# Altium schematic sheet Connector A.SchDoc
size A4; SheetNumber: 12; SheetTotal: 16
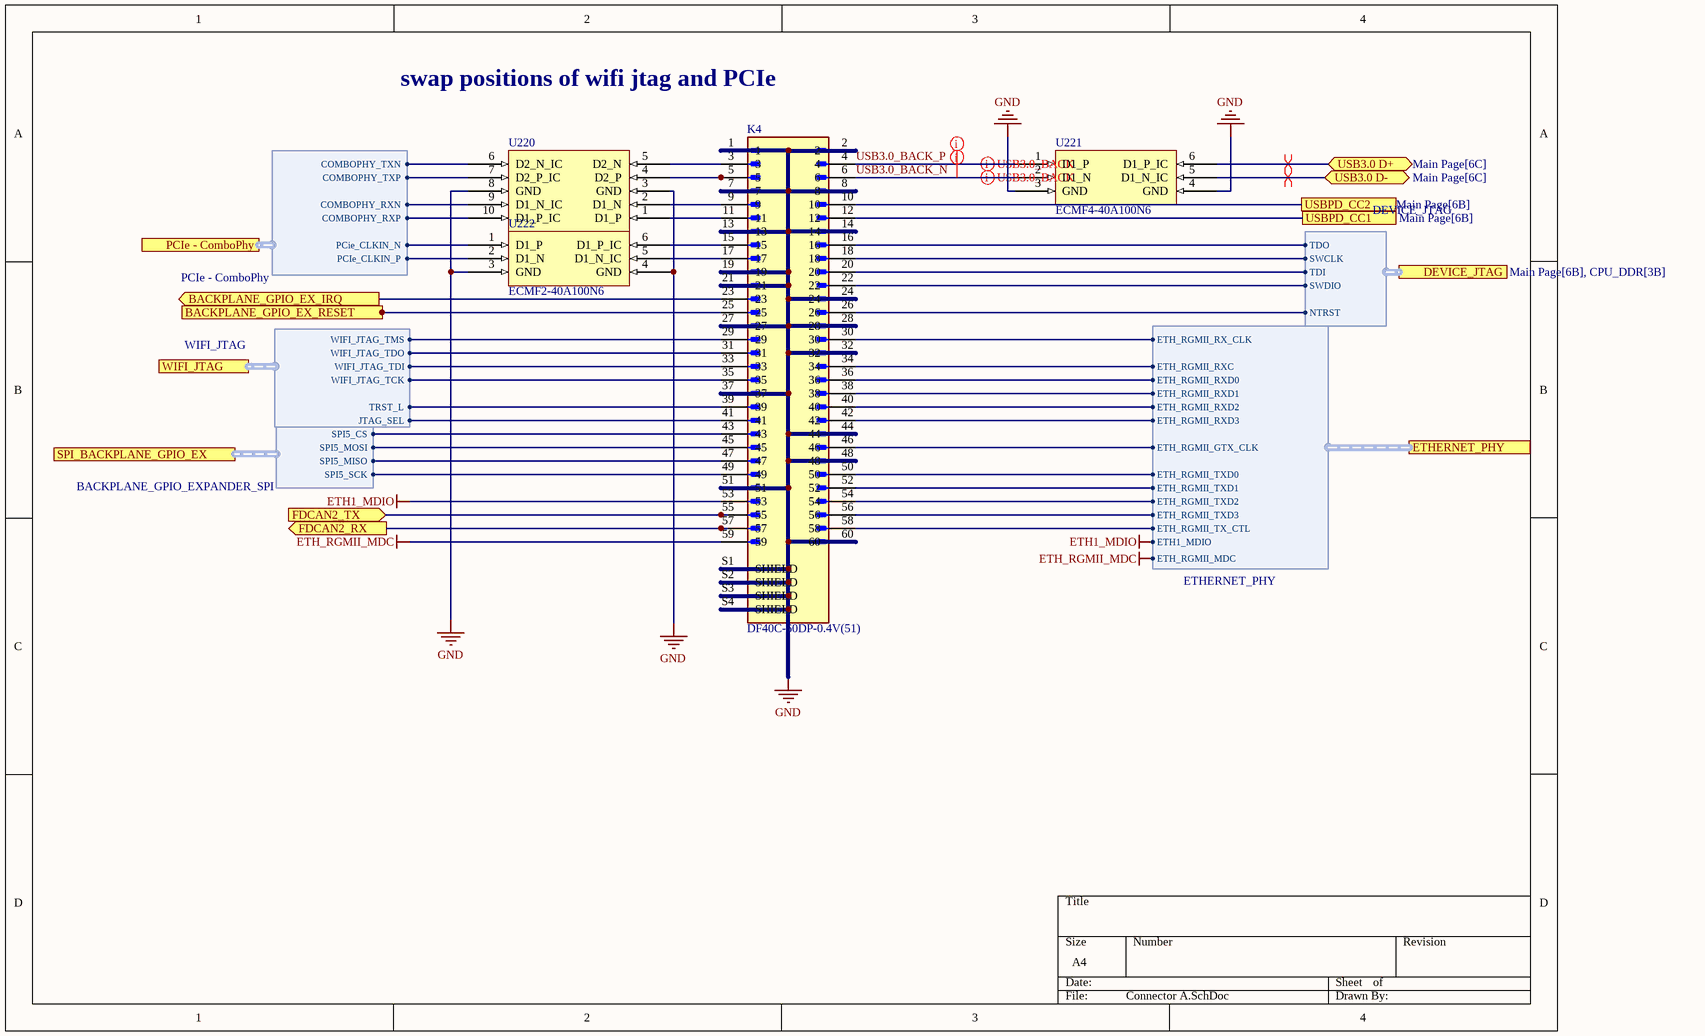
[diagram p0: Connector A.SchDoc]

## Parts
K4  DF40C-60DP-0.4V(51)  [HIROSE_DF40C-60DP-0.4V(51)]
U220  ECMF4-40A100N10  [ECMF4-40A100N10]  (value not drawn)
U221  ECMF4-40A100N6  [ECMF2-40A100N6]
U222  ECMF2-40A100N6  [ECMF2-40A100N6]

## Ports
BACKPLANE_GPIO_EX_IRQ (out, see Main Page[6C]), BACKPLANE_GPIO_EX_RESET (in, see Main Page[6C]), DEVICE_JTAG (harness DEVICE_JTAG, see Main Page[6B], CPU_DDR[3B]), ETHERNET_PHY (harness ETHERNET_PHY, see Main Page[6B]), FDCAN2_RX (out, see Main Page[6C], CPU_Peripherals[4E]), FDCAN2_TX (in, see Main Page[6B], CPU_Peripherals[4E]), PCIe - ComboPhy (harness PCIe - ComboPhy, see Main Page[6B]), SPI_BACKPLANE_GPIO_EX (harness BACKPLANE_GPIO_EXPANDER_SPI, see Main Page[6B], CPU_Peripherals[0B]), USB3.0 D+ (bidir, see Main Page[6C]), USB3.0 D- (bidir, see Main Page[6C]), USBPD_CC1 (see Main Page[6B]), USBPD_CC2 (see Main Page[6B]), WIFI_JTAG (harness WIFI_JTAG, see Main Page[6C], WIFI and BLE[6B])

## Harnesses
DEVICE_JTAG: NTRST, SWCLK, SWDIO, TDI, TDO
WIFI_JTAG: JTAG_SEL, TRST_L, WIFI_JTAG_TCK, WIFI_JTAG_TDI, WIFI_JTAG_TDO, WIFI_JTAG_TMS
PCIe - ComboPhy: COMBOPHY_RXN, COMBOPHY_RXP, COMBOPHY_TXN, COMBOPHY_TXP, PCie_CLKIN_N, PCIe_CLKIN_P
ETHERNET_PHY: ETH_RGMII_GTX_CLK, ETH_RGMII_RXC, ETH_RGMII_RXD0, ETH_RGMII_RXD1, ETH_RGMII_RXD2, ETH_RGMII_RXD3, ETH_RGMII_RX_CLK, ETH_RGMII_TXD0, ETH_RGMII_TXD1, ETH_RGMII_TXD2, ETH_RGMII_TXD3, ETH_RGMII_TX_CTL, ETH1_MDIO, ETH_RGMII_MDC
BACKPLANE_GPIO_EXPANDER_SPI: SPI5_SCK, SPI5_MOSI, SPI5_MISO, SPI5_CS

## Nets
ETH1_MDIO: K4.53 ; port ETHERNET_PHY.ETH1_MDIO
ETH_RGMII_MDC: K4.59 ; port ETHERNET_PHY.ETH_RGMII_MDC
GND: K4.1 K4.2 K4.7 K4.8 K4.13 K4.14 K4.19 K4.21 K4.24 K4.27 K4.28 K4.32 K4.37 K4.44 K4.48 K4.51 K4.60 K4.S1(SHIELD) K4.S2(SHIELD) K4.S3(SHIELD) K4.S4(SHIELD) U220.3(GND) U220.8(GND) U221.3(GND) U221.4(GND) U222.3(GND) U222.4(GND)
BACKPLANE_GPIO_EX_IRQ: K4.23 ; port BACKPLANE_GPIO_EX_IRQ
BACKPLANE_GPIO_EX_RESET: K4.25 ; port BACKPLANE_GPIO_EX_RESET
FDCAN2_RX: K4.57 ; port FDCAN2_RX
FDCAN2_TX: K4.55 ; port FDCAN2_TX
USB3.0 D+: U221.6(D1_P_IC) ; port USB3.0 D+
USB3.0 D-: U221.5(D1_N_IC) ; port USB3.0 D-
USB3.0_BACK_N: K4.6 U221.2(D1_N)
USB3.0_BACK_P: K4.4 U221.1(D1_P)
USBPD_CC1: K4.12 ; port USBPD_CC1
USBPD_CC2: K4.10 ; port USBPD_CC2
NetK4_3: K4.3 U220.5(D2_N)
NetK4_5: K4.5 U220.4(D2_P)
NetK4_9: K4.9 U220.2(D1_N)
NetK4_11: K4.11 U220.1(D1_P)
NetK4_15: K4.15 U222.6(D1_P_IC)
NetK4_16: K4.16 ; port DEVICE_JTAG.TDO
NetK4_17: K4.17 U222.5(D1_N_IC)
NetK4_18: K4.18 ; port DEVICE_JTAG.SWCLK
NetK4_20: K4.20 ; port DEVICE_JTAG.TDI
NetK4_22: K4.22 ; port DEVICE_JTAG.SWDIO
NetK4_26: K4.26 ; port DEVICE_JTAG.NTRST
NetK4_29: K4.29 ; port WIFI_JTAG.WIFI_JTAG_TMS
NetK4_30: K4.30 ; port ETHERNET_PHY.ETH_RGMII_RX_CLK
NetK4_31: K4.31 ; port WIFI_JTAG.WIFI_JTAG_TDO
NetK4_33: K4.33 ; port WIFI_JTAG.WIFI_JTAG_TDI
NetK4_34: K4.34 ; port ETHERNET_PHY.ETH_RGMII_RXC
NetK4_35: K4.35 ; port WIFI_JTAG.WIFI_JTAG_TCK
NetK4_36: K4.36 ; port ETHERNET_PHY.ETH_RGMII_RXD0
NetK4_38: K4.38 ; port ETHERNET_PHY.ETH_RGMII_RXD1
NetK4_39: K4.39 ; port WIFI_JTAG.TRST_L
NetK4_40: K4.40 ; port ETHERNET_PHY.ETH_RGMII_RXD2
NetK4_41: K4.41 ; port WIFI_JTAG.JTAG_SEL
NetK4_42: K4.42 ; port ETHERNET_PHY.ETH_RGMII_RXD3
NetK4_43: K4.43 ; port SPI_BACKPLANE_GPIO_EX.SPI5_CS
NetK4_45: K4.45 ; port SPI_BACKPLANE_GPIO_EX.SPI5_MOSI
NetK4_46: K4.46 ; port ETHERNET_PHY.ETH_RGMII_GTX_CLK
NetK4_47: K4.47 ; port SPI_BACKPLANE_GPIO_EX.SPI5_MISO
NetK4_49: K4.49 ; port SPI_BACKPLANE_GPIO_EX.SPI5_SCK
NetK4_50: K4.50 ; port ETHERNET_PHY.ETH_RGMII_TXD0
NetK4_52: K4.52 ; port ETHERNET_PHY.ETH_RGMII_TXD1
NetK4_54: K4.54 ; port ETHERNET_PHY.ETH_RGMII_TXD2
NetK4_56: K4.56 ; port ETHERNET_PHY.ETH_RGMII_TXD3
NetK4_58: K4.58 ; port ETHERNET_PHY.ETH_RGMII_TX_CTL
NetU220_6: U220.6(D2_N_IC) ; port PCIe - ComboPhy.COMBOPHY_TXN
NetU220_7: U220.7(D2_P_IC) ; port PCIe - ComboPhy.COMBOPHY_TXP
NetU220_9: U220.9(D1_N_IC) ; port PCIe - ComboPhy.COMBOPHY_RXN
NetU220_10: U220.10(D1_P_IC) ; port PCIe - ComboPhy.COMBOPHY_RXP
NetU222_1: U222.1(D1_P) ; port PCIe - ComboPhy.PCie_CLKIN_N
NetU222_2: U222.2(D1_N) ; port PCIe - ComboPhy.PCIe_CLKIN_P

## Layout directives
differential pair: USB3.0 D+, USB3.0 D-, USB3.0_BACK_N, USB3.0_BACK_P
net class High Speed Digital: USB3.0_BACK_N, USB3.0_BACK_P

## Notes on the sheet
- swap positions of wifi jtag and PCIe

## Library data of the parts
K4 = DF40C-60DP-0.4V(51): 60 Position Connector Plug, Outer Shroud Contacts Surface Mount Gold; MF: Hirose Electric; Value: *; Purchase-URL: https://pricing.snapeda.com/search/part/DF40C-60DP-0.4V(51)/?ref=eda; MP: DF40C-60DP-0.4V(51); Price: None; Package: None; Availability: In Stock; SnapEDA_Link: https://www.snapeda.com/parts/DF40C-60DP-0.4V(51)/Hirose+Electric+Co+Ltd/view-part/?ref=snap; Check_prices: https://www.snapeda.com/parts/DF40C-60DP-0.4V(51)/Hirose+Electric+Co+Ltd/view-part/?ref=eda
U220 = ECMF4-40A100N10: 4 Line Common Mode Choke Surface Mount 100mA DCR 3Ohm (Typ); ComponentLink1Description: New link; ComponentLink1URL: https://www.digikey.com/en/products/detail/stmicroelectronics/ECMF4-40A100N10/16379603
U221 = ECMF4-40A100N6: 2 Line Common Mode Choke Surface Mount 100mA DCR 3Ohm (Typ)
U222 = ECMF2-40A100N6: 2 Line Common Mode Choke Surface Mount 100mA DCR 3Ohm (Typ); Supplier 1: Arrow Electronics; Supplier Part Number 1: ECMF2-40A100N6